# Altium project Ethernet2MIL Adapter.PrjPcb (part 1 of 3)
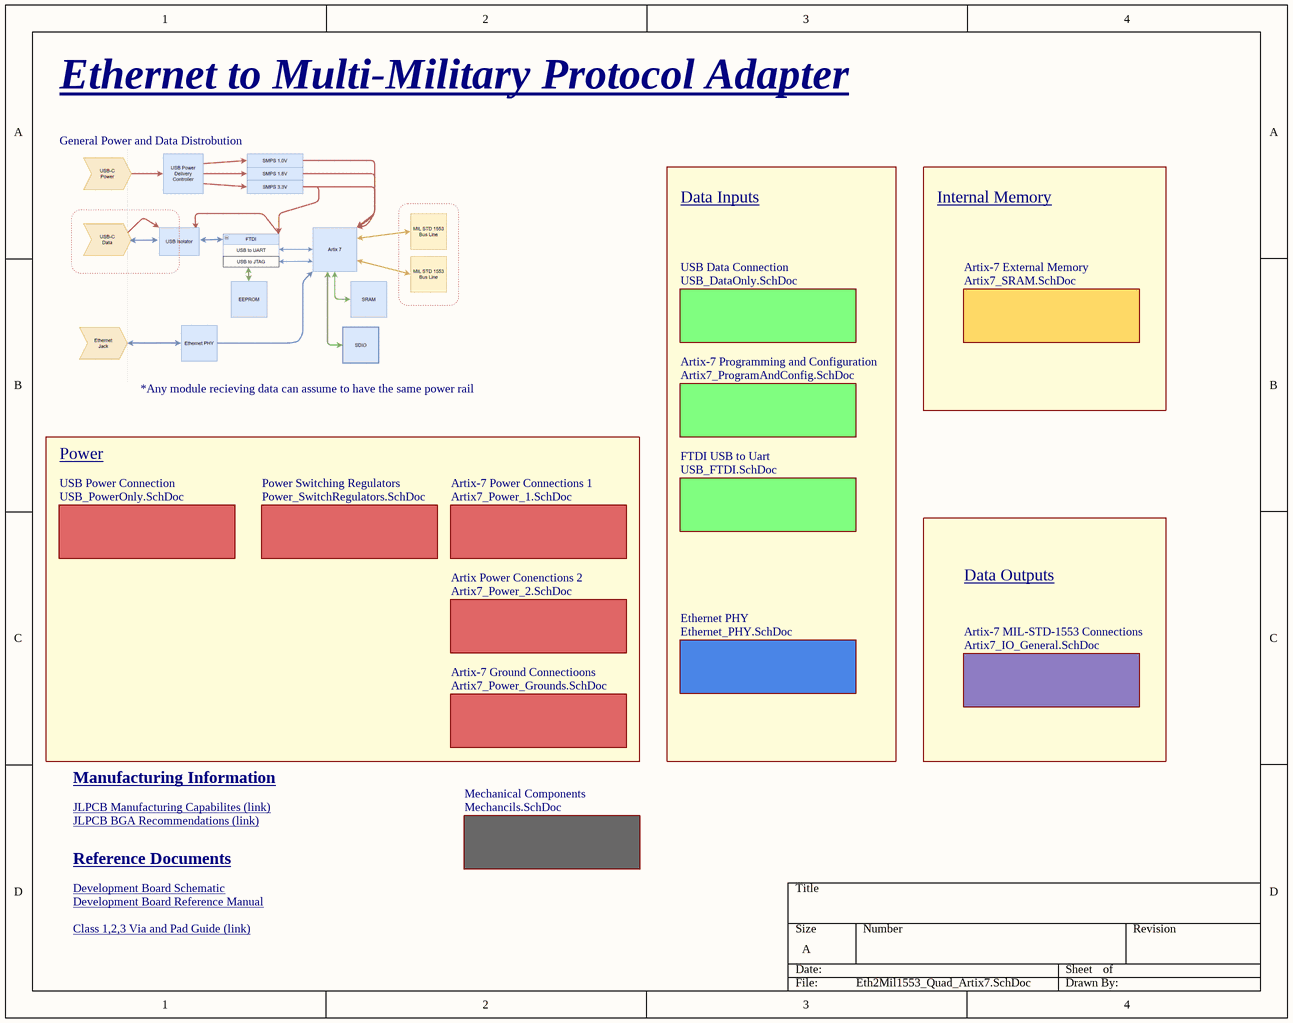
[diagram p0: Eth2Mil1553_Quad_Artix7.SchDoc]
Author: Cody States
13 sheets, 283 parts. Net scope: hierarchical (ports join the sheet entries above them; power ports are global).
Board file: Ethernet2Mil_Adapter_Dual.PcbDoc
Sheets:
  Eth2Mil1553_Quad_Artix7.SchDoc
    Artix-7 MIL-STD-1553 Connections = Artix7_IO_General.SchDoc
      1A = IO_MIL1553_TopConfiguration.SchDoc
      1B = IO_MIL1553_TopConfiguration.SchDoc
    Artix-7 Power Connections 1 = Artix7_Power_1.SchDoc
    Artix-7 Ground Connectioons = Artix7_Power_Grounds.SchDoc
    Artix-7 External Memory = Artix7_SRAM.SchDoc
    Ethernet PHY = Ethernet_PHY.SchDoc
    Mechanical Components = Mechancils.SchDoc
    Power Switching Regulators = Power_SwitchRegulators.SchDoc
    FTDI USB to Uart = USB_FTDI.SchDoc
    USB Power Connection = USB_PowerOnly.SchDoc
    USB Data Connection = USB_DataOnly.SchDoc
    Artix-7 Programming and Configuration = Artix7_ProgramAndConfig.SchDoc

## Sheet Eth2Mil1553_Quad_Artix7.SchDoc: STM32 MPU2 - Artix 7 Device Template
size A; SheetNumber: 1; SheetTotal: 14

### Sub-sheets
Artix Power Conenctions 2 = Artix7_Power_2.SchDoc (file not in this document): no entries
Artix-7 External Memory = Artix7_SRAM.SchDoc: no entries
Artix-7 Ground Connectioons = Artix7_Power_Grounds.SchDoc: no entries
Artix-7 MIL-STD-1553 Connections = Artix7_IO_General.SchDoc: no entries
Artix-7 Power Connections 1 = Artix7_Power_1.SchDoc: no entries
Artix-7 Programming and Configuration = Artix7_ProgramAndConfig.SchDoc: no entries
Ethernet PHY = Ethernet_PHY.SchDoc: no entries
FTDI USB to Uart = USB_FTDI.SchDoc: no entries
Mechanical Components = Mechancils.SchDoc: no entries
Power Switching Regulators = Power_SwitchRegulators.SchDoc: no entries
USB Data Connection = USB_DataOnly.SchDoc: no entries
USB Power Connection = USB_PowerOnly.SchDoc: no entries

### Notes on the sheet
- Ethernet to Multi-Military Protocol Adapter
- General Power and Data Distrobution
- Data Inputs
- Internal Memory
- *Any module recieving data can assume to have the same power rail
- Power
- Data Outputs
- JLPCB Manufacturing Capabilites (link) <https://jlcpcb.com/capabilities/pcb-capabilities>
- Manufacturing Information
- JLPCB BGA Recommendations (link) <https://jlcpcb.com/help/article/BGA-Design-Guidelines---PCB-Layout-Recommendations-for-BGA-packages>
- Reference Documents
- Development Board Schematic <https://digilent.com/reference/_media/reference/programmable-logic/cmod-a7/cmod_a7_sch_rev_c0.pdf?_gl=1*qkxv5u*_gcl_au*MjAxOTQ5MDM5OS4xNzQ2MzA4ODg3*_ga*MTA3MTgyNDA3MS4xNzQ0ODY4ODUx*_ga_JSPEFFCPBT*czE3NDc5NTE0MjMkbzQkZzEkdDE3NDc5NTE0MzAkajUzJGwwJGgxNjE3MDA2NTU0JGRWWFB3c3o4VGxNS2E4azhxR0phdjBGWmxjNUNlb0pRdkNR>
- Development Board Reference Manual <https://digilent.com/reference/programmable-logic/cmod-a7/reference-manual?redirect=1>
- Class 1,2,3 Via and Pad Guide (link) <https://resources.altium.com/p/pcb-size-and-pad-size-guidelines>

## Sheet Artix7_IO_General.SchDoc
size A3; SheetNumber: 12; SheetTotal: 14
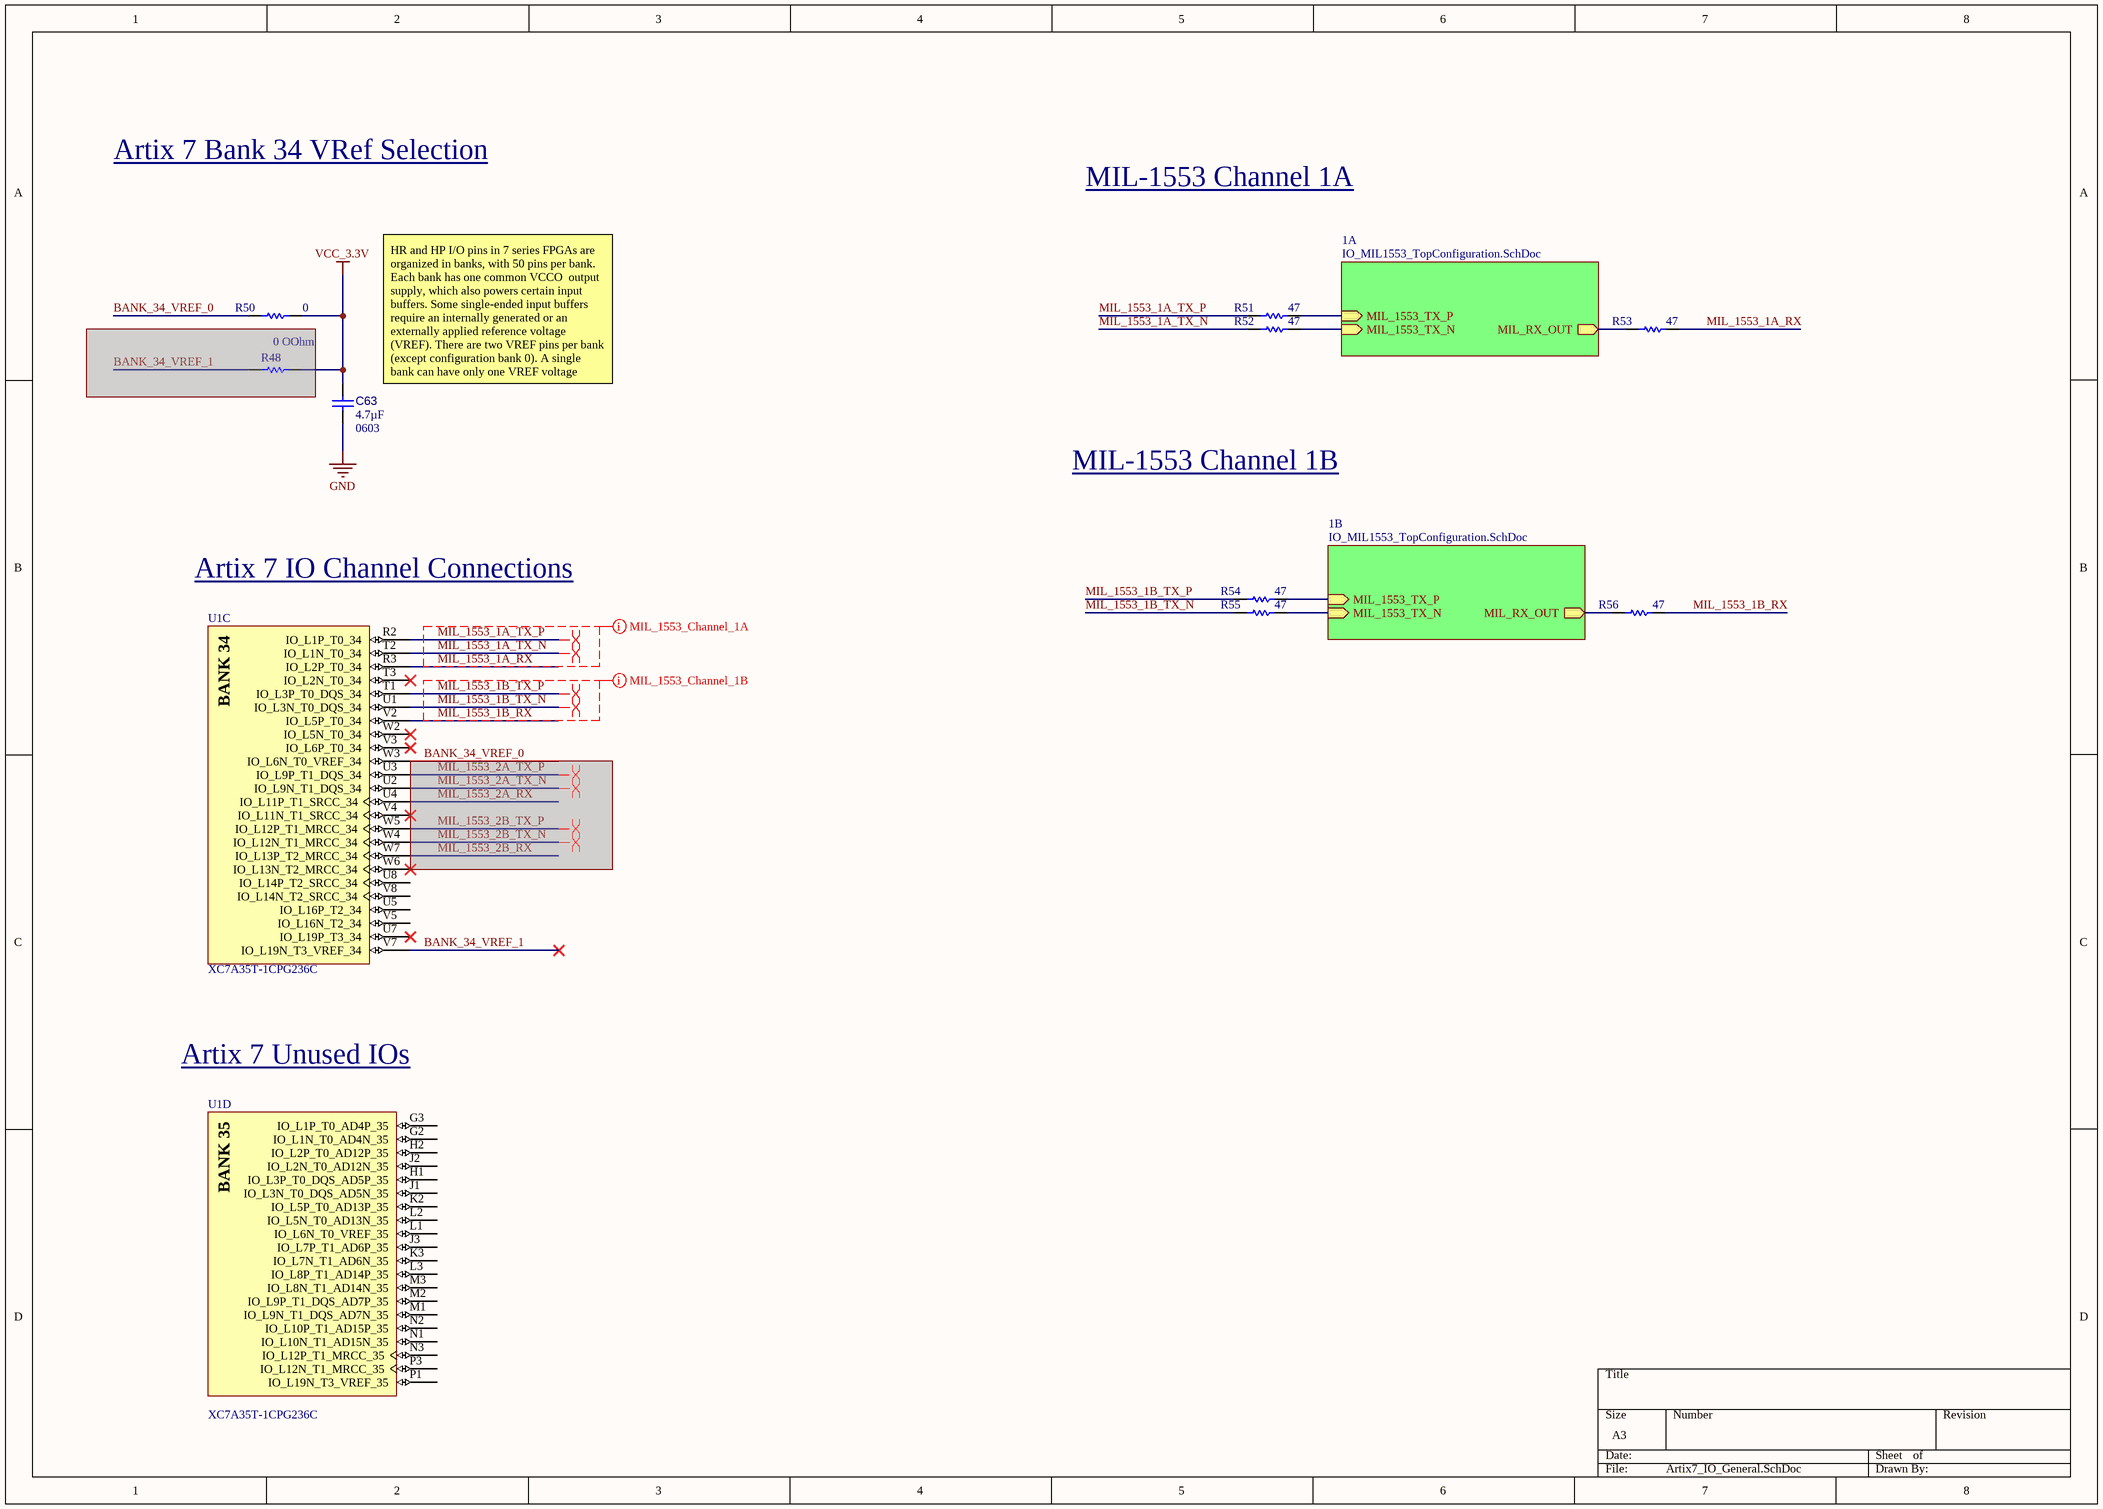
[diagram p1: Artix7_IO_General.SchDoc]

### Parts
C63  value 4.7µF  Case/Package: 0603  [CAPC0603(1608)100_L]  (hidden comment: Capacitor 4.7µF +/-20% 10V 0603)
R48  value 0 OOhm  [RESC1005X40X25ML05T05]  (hidden comment: Resistor 1k +/-1% 0402 100 mW)  (net tie)  (masked out: inside a compile mask, not in the netlist)
R50  value 0  [RESC1005X40X25ML05T05]  (hidden comment: Resistor 1k +/-1% 0402 100 mW)  (net tie)
R51  value 47  [RESC1005X40X25LL10T10]  (hidden comment: ERA-2AEB470X)
R52  value 47  [RESC1005X40X25LL10T10]  (hidden comment: ERA-2AEB470X)
R53  value 47  [RESC1005X40X25LL10T10]  (hidden comment: ERA-2AEB470X)
R54  value 47  [RESC1005X40X25LL10T10]  (hidden comment: ERA-2AEB470X)
R55  value 47  [RESC1005X40X25LL10T10]  (hidden comment: ERA-2AEB470X)
R56  value 47  [RESC1005X40X25LL10T10]  (hidden comment: ERA-2AEB470X)
U1  XC7A35T-1CPG236C  [CPG236]  (parts C,D of 10)

### Sub-sheets
1A = IO_MIL1553_TopConfiguration.SchDoc: MIL_1553_TX_N (in), MIL_1553_TX_P (in), MIL_RX_OUT (out)
1B = IO_MIL1553_TopConfiguration.SchDoc: MIL_1553_TX_N (in), MIL_1553_TX_P (in), MIL_RX_OUT (out)

### Nets
GND: C63.2
VCC_3.3V: C63.1 R50.1
BANK_34_VREF_0: R50.2
BANK_34_VREF_1: U1.V7(IO_L19N_T3_VREF_34)
MIL_1553_1A_RX: R53.2 U1.R3(IO_L2P_T0_34)
MIL_1553_1A_TX_N: R52.1 U1.T2(IO_L1N_T0_34)
MIL_1553_1A_TX_P: R51.1 U1.R2(IO_L1P_T0_34)
MIL_1553_1B_RX: R56.2 U1.V2(IO_L5P_T0_34)
MIL_1553_1B_TX_N: R55.1 U1.U1(IO_L3N_T0_DQS_34)
MIL_1553_1B_TX_P: R54.1 U1.T1(IO_L3P_T0_DQS_34)
RX_OUT: R53.1 ; sheet 1A/MIL_RX_OUT
RX_OUT: R56.1 ; sheet 1B/MIL_RX_OUT  [a separate net that carries the same name]
TX_OUT_N: R52.2 ; sheet 1A/MIL_1553_TX_N
TX_OUT_N: R55.2 ; sheet 1B/MIL_1553_TX_N  [a separate net that carries the same name]
TX_OUT_P: R51.2 ; sheet 1A/MIL_1553_TX_P
TX_OUT_P: R54.2 ; sheet 1B/MIL_1553_TX_P  [a separate net that carries the same name]

Not connected (* = marked no-connect by the designer): U1 G2(IO_L1N_T0_AD4N_35) G3(IO_L1P_T0_AD4P_35) H1(IO_L3P_T0_DQS_AD5P_35) H2(IO_L2P_T0_AD12P_35) J1(IO_L3N_T0_DQS_AD5N_35) J2(IO_L2N_T0_AD12N_35) J3(IO_L7P_T1_AD6P_35) K2(IO_L5P_T0_AD13P_35) K3(IO_L7N_T1_AD6N_35) L1(IO_L6N_T0_VREF_35) L2(IO_L5N_T0_AD13N_35) L3(IO_L8P_T1_AD14P_35) M1(IO_L9N_T1_DQS_AD7N_35) M2(IO_L9P_T1_DQS_AD7P_35) M3(IO_L8N_T1_AD14N_35) N1(IO_L10N_T1_AD15N_35) N2(IO_L10P_T1_AD15P_35) N3(IO_L12P_T1_MRCC_35) P1(IO_L19N_T3_VREF_35) P3(IO_L12N_T1_MRCC_35) T3(IO_L2N_T0_34)* U2(IO_L9N_T1_DQS_34) U3(IO_L9P_T1_DQS_34) U4(IO_L11P_T1_SRCC_34) U5(IO_L16P_T2_34) U7(IO_L19P_T3_34)* U8(IO_L14P_T2_SRCC_34) V3(IO_L6P_T0_34)* V4(IO_L11N_T1_SRCC_34)* V5(IO_L16N_T2_34) V8(IO_L14N_T2_SRCC_34) W2(IO_L5N_T0_34)* W3(IO_L6N_T0_VREF_34) W4(IO_L12N_T1_MRCC_34) W5(IO_L12P_T1_MRCC_34) W6(IO_L13N_T2_MRCC_34)* W7(IO_L13P_T2_MRCC_34)

### Layout directives
differential pair: (no net found under the mark), MIL_1553_1A_TX_N, MIL_1553_1A_TX_P, MIL_1553_1B_TX_N, MIL_1553_1B_TX_P
net class MIL1553 Channel 1A: MIL_1553_1A_RX, MIL_1553_1A_TX_N, MIL_1553_1A_TX_P
net class MIL1553 Channel 1B: MIL_1553_1B_RX, MIL_1553_1B_TX_N, MIL_1553_1B_TX_P

### Notes on the sheet
- Artix 7 Bank 34 VRef Selection
- MIL-1553 Channel 1A
- (near C63) HR and HP I/O pins in 7 series FPGAs are organized in banks, with 50 pins per bank. Each bank has one common VCCO  output supply, which also powers certain input buffers. Some single-ended input buffers require an internally generated or an  externally applied reference voltage (VREF). There are two VREF pins per bank (except configuration bank 0). A single bank can have only one VREF voltage value.
- MIL-1553 Channel 1B
- Artix 7 IO Channel Connections
- Artix 7 Unused IOs
- (in symbol CMP-0383-00006-1, part C) BANK 34
- (in symbol CMP-0383-00006-1, part D) BANK 35

### Library data of the parts
C63 = CMP-001-00076-5: Chip Capacitor, 4.7µF +/-20%, 10V, 0603, Thickness 1 mm; Tolerance: 10%; Max Operating Temperature: 85°C; Voltage Rating: 10V; Min Operating Temperature: -55°C; Pins: 2; Mounting Technology: SMT
R48 R50 = CMP-009-00009-5: Chip Resistor, 1 KOhm, +/- 1%, 0.1 W, -55 to 155 degC, 0402 (1005 Metric); Voltage Rating: 50V; Power: 100mW; Max Operating Temperature: 155°C; Tolerance: 1%; Case/Package: 0402; Min Operating Temperature: -55°C; RoHS Compliant: True; Mounting Technology: SM; Pins: 2
R51-R56 = CMP-009-00190-1: Fixed Resistor, Thin Film, 0.063W, 47ohm, 50V, 0.1% +/-Tol, 25ppm/Cel, Surface Mount, 0402; Power: 63mW; Min Operating Temperature: -55°C; Tolerance: 0.1%; Mounting Technology: Surface Mount; Max Operating Temperature: 155°C; RoHS Compliant: Yes; Case/Package: 0402; Pins: 2
U1 = CMP-0383-00006-1: Artix-7 FPGA, 106 User I/Os, 2 GTP, 238-Ball BGA, Speed Grade 1, Commercial Grade, Pb-Free; Manufacturer: Xilinx; CMTs: 5; Total Block RAM: 1800 Kb; Logic Cells: 33280; Speed Grades: 1; GTP: 2; Available User I/O: 106; ComponentLink1URL: http://www.xilinx.com/; Maximum Distributed RAM: 400 Kb; PackageVersion: Rev. 1.11; PartNumber: XC7A35T-1CPG236C; ComponentLink2URL: http://www.xilinx.com/support/documentation/data_sheets/ds180_7Series_Overview.pdf; DatasheetVersion: Rev. 1.15; ComponentLink1Description: Manufacturer URL; ComponentLink3Description: Pinout; ComponentLink4Description: Package Specification; Mounting Technology: Surface Mount; PackageReference: CPG-236; Operating Temperature Range: Commercial; PackageDescription: 238-Ball Wire-Bond Chip-Scale BGA, Body 10 x10 mm, Pitch 0.5 mm; ComponentLink3URL: http://www.xilinx.com/support/documentation/user_guides/ug475_7Series_Pkg_Pinout.pdf; ComponentLink4URL: http://www.xilinx.com/support/documentation/user_guides/ug475_7Series_Pkg_Pinout.pdf; ComponentLink2Description: Datasheet

## Sheet IO_MIL1553_TopConfiguration.SchDoc
size A3; SheetNumber: 13; SheetTotal: 14
Used 2 times, as channels Artix-7 MIL-STD-1553 Connections/1A, Artix-7 MIL-STD-1553 Connections/1B. Parts and nets are listed once, with the designators drawn on the sheet.
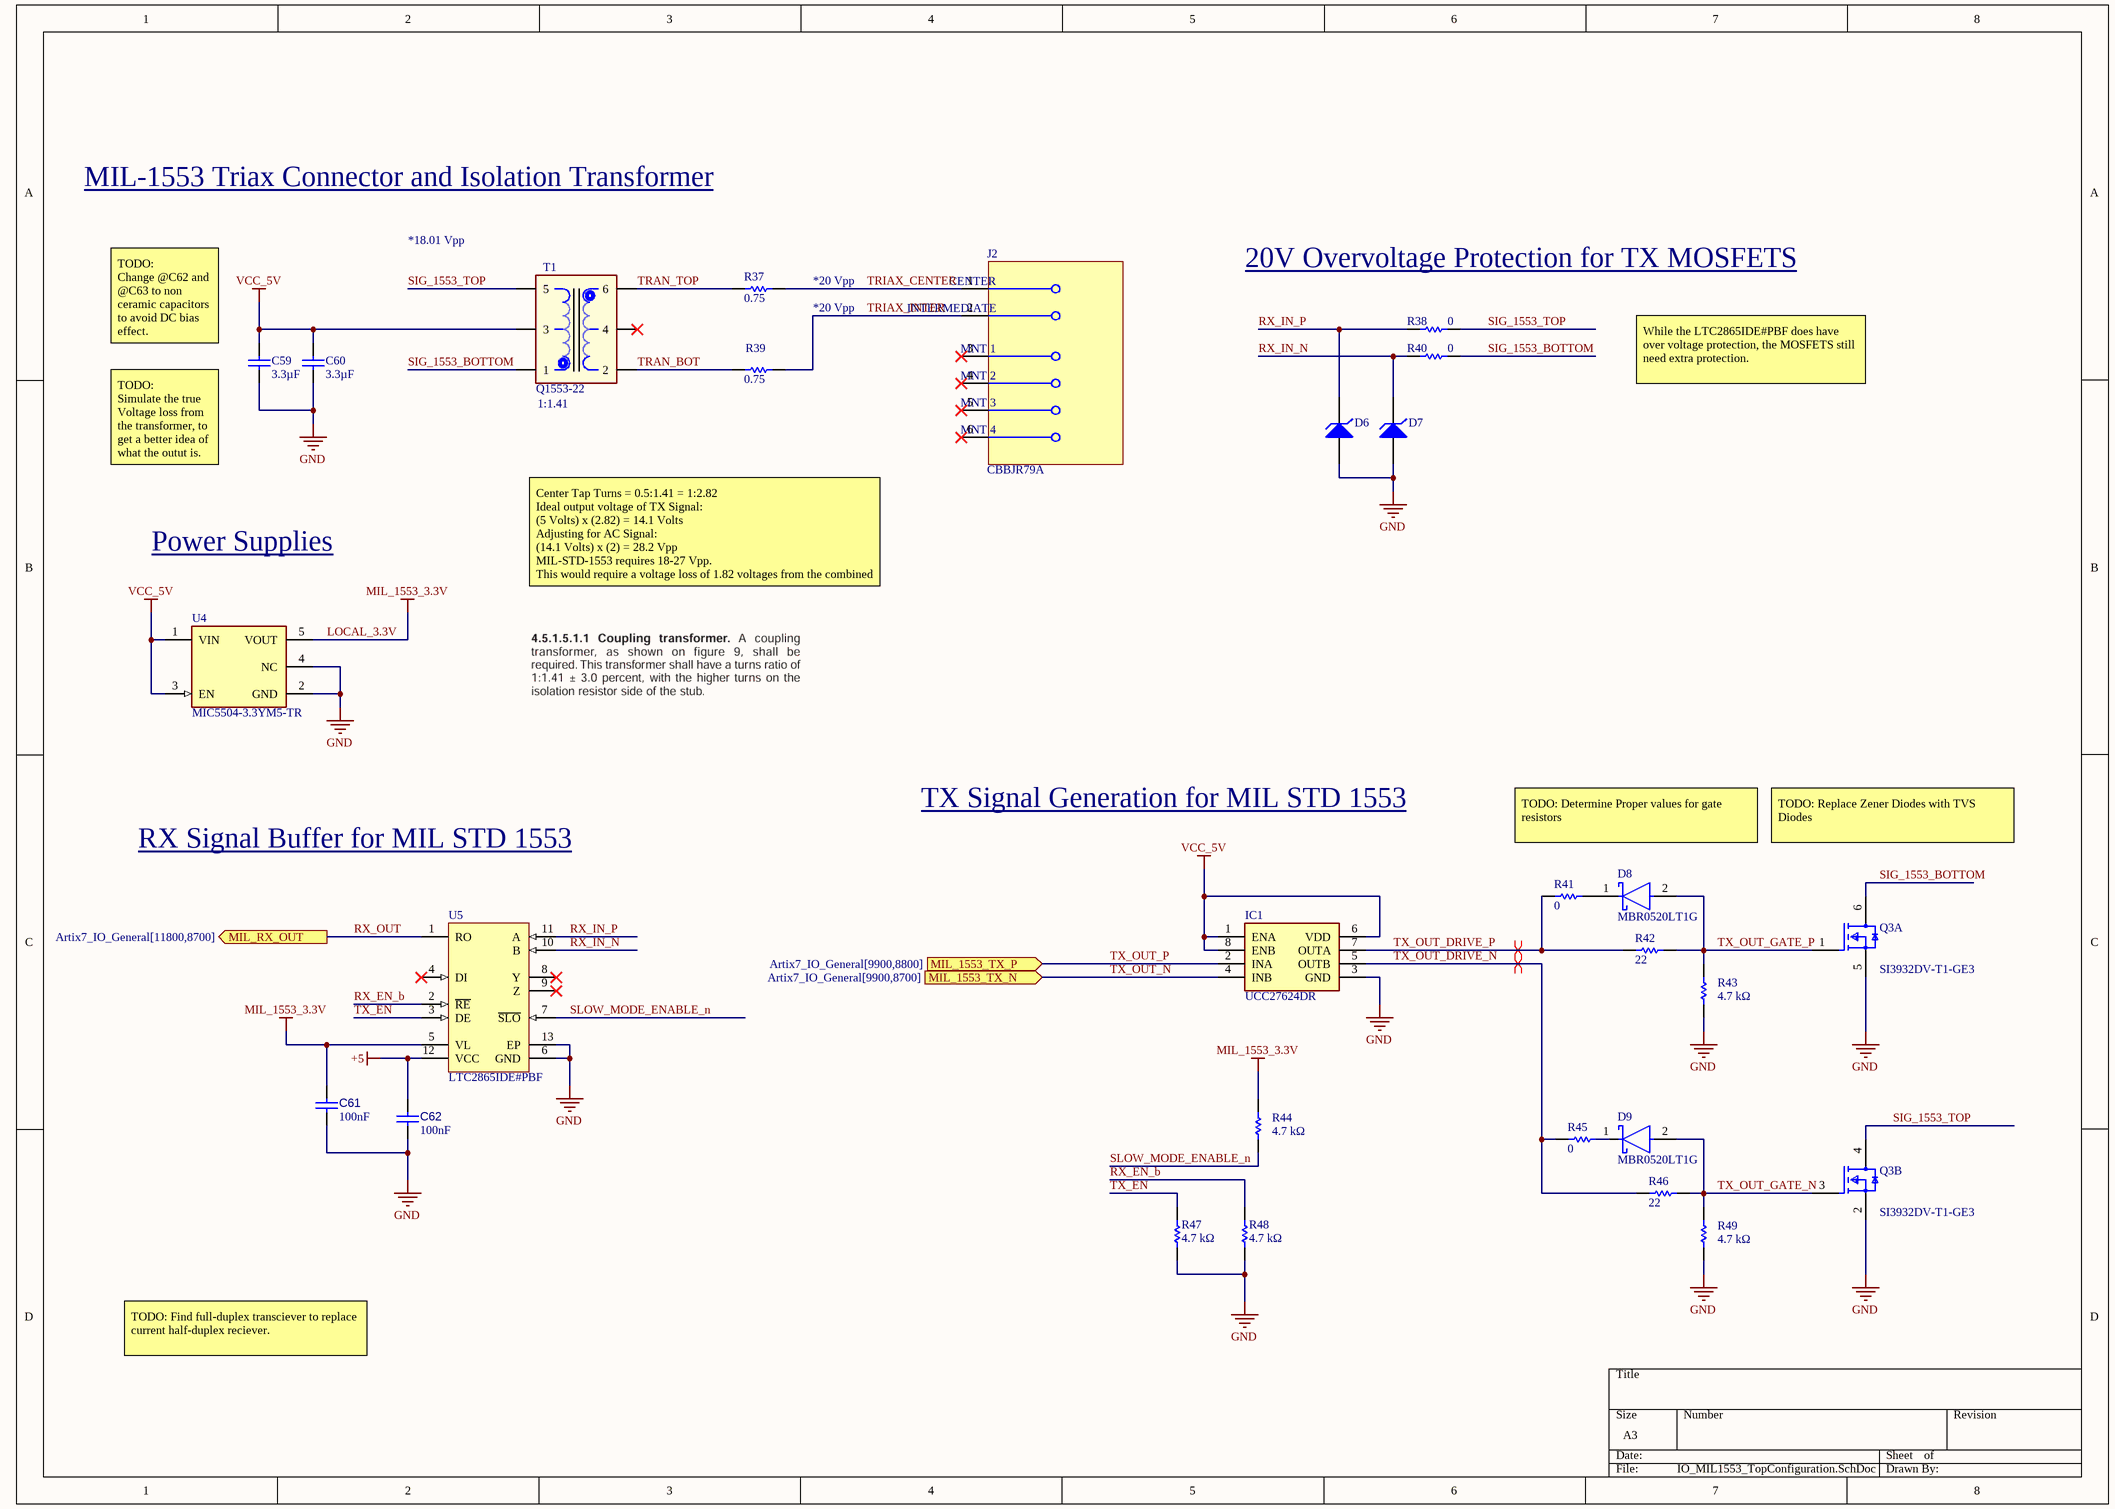
[diagram p2: IO_MIL1553_TopConfiguration.SchDoc]

### Parts
C59  value 3.3µF  [CAPC3325X279X50NL40T25]  (hidden comment: 12105C335KAT2A)
C60  value 3.3µF  [CAPC3325X279X50NL40T25]  (hidden comment: 12105C335KAT2A)
C61  value 100nF  [CAPC2013X145X48ML20T23]  (hidden comment: VJ0805Y104JXXAT)
C62  value 100nF  [CAPC2013X145X48ML20T23]  (hidden comment: VJ0805Y104JXXAT)
D6  SZ1SMA5932BT3G  [ONSC-SMA-2-403D-02_F_V]  (value not drawn)
D7  SZ1SMA5932BT3G  [ONSC-SMA-2-403D-02_F_V]  (value not drawn)
D8  MBR0520LT1G  [FP-425-04-IPC_A]
D9  MBR0520LT1G  [FP-425-04-IPC_A]
IC1  UCC27624DR  [SOIC127P600X175-8N]
J2  CBBJR79A  [CBBJR79A_MFG]
Q3  SI3932DV-T1-GE3  [FP-C-06593-6-IPC_B]  (parts A,B of 2)
R37  value 0.75  [RESC3125X70X40LL20T20]  (hidden comment: RES_0.75ohm_1W _1210)
R38  value 0  [RESC1608X55X25ML10T15]  (hidden comment: Resistor 0R +/- 5% 0603 100 mW)
R39  value 0.75  [RESC3125X70X40LL20T20]  (hidden comment: RES_0.75ohm_1W _1210)
R40  value 0  [RESC1608X55X25ML10T15]  (hidden comment: Resistor 0R +/- 5% 0603 100 mW)
R41  value 0  [RESC1608X55X25ML10T15]  (hidden comment: Resistor 0R +/- 5% 0603 100 mW)
R42  value 22  [RESC1608X55X25LL10T15]  (hidden comment: RC0603FR-0722RL)
R43  Resistance: 4.7 kΩ  [RESC1608X55X30LL15T15]  (hidden comment: ERJ-3EKF4701V)
R44  Resistance: 4.7 kΩ  [RESC1608X55X30LL15T15]  (hidden comment: ERJ-3EKF4701V)
R45  value 0  [RESC1608X55X25ML10T15]  (hidden comment: Resistor 0R +/- 5% 0603 100 mW)
R46  value 22  [RESC1608X55X25LL10T15]  (hidden comment: RC0603FR-0722RL)
R47  Resistance: 4.7 kΩ  [RESC1608X55X30LL15T15]  (hidden comment: ERJ-3EKF4701V)
R48  Resistance: 4.7 kΩ  [RESC1608X55X30LL15T15]  (hidden comment: ERJ-3EKF4701V)
R49  Resistance: 4.7 kΩ  [RESC1608X55X30LL15T15]  (hidden comment: ERJ-3EKF4701V)
T1  Turns Ratio: 1:1.41  [New footprint 1]  (hidden comment: Q1553-22)
U4  MIC5504-3.3YM5-TR  [FP-SOT23-5LD-PL-1-MFG]
U5  LTC2865IDE#PBF  [LT-DE-UE-12_V]

### Ports
MIL_1553_TX_N (in, see Artix7_IO_General[9900,8700]), MIL_1553_TX_P (in, see Artix7_IO_General[9900,8800]), MIL_RX_OUT (out, see Artix7_IO_General[11800,8700])

### Nets
+5: C62.2 U5.12(VCC)
GND: C59.1 C60.1 C61.1 C62.1 D6.2(A) D7.2(A) IC1.3(GND) Q3.2(S2) Q3.5(S1) R43.1 R47.1 R48.2 R49.1 U4.2(GND) U4.4(NC) U5.6(GND) U5.13(EP)
MIL_1553_3.3V: C61.2 R44.2 U4.5(VOUT) U5.5(VL)  [also labelled LOCAL_3.3V]
VCC_5V: C59.2 C60.2 IC1.1(ENA) IC1.6(VDD) IC1.8(ENB) T1.3 U4.1(VIN) U4.3(EN)
RX_EN_b: R48.1 U5.2(~{RE})
RX_IN_N: D7.1(K) R40.1 U5.10(B)
RX_IN_P: D6.1(K) R38.1 U5.11(A)
RX_OUT: U5.1(RO) ; port MIL_RX_OUT
SIG_1553_BOTTOM: Q3.6(D1) R40.2 T1.1
SIG_1553_TOP: Q3.4(D2) R38.2 T1.5
SLOW_MODE_ENABLE_n: R44.1 U5.7(~{SLO})
TRAN_BOT: R39.1 T1.2
TRAN_TOP: R37.1 T1.6
TRIAX_CENTER: J2.1(CENTER) R37.2
TRIAX_INTER: J2.2(INTERMEDIATE) R39.2
TX_EN: R47.2 U5.3(DE)
TX_OUT_DRIVE_N: IC1.5(OUTB) R45.1 R46.1
TX_OUT_DRIVE_P: IC1.7(OUTA) R41.1 R42.1
TX_OUT_GATE_N: D9.2(A) Q3.3(G2) R46.2 R49.2
TX_OUT_GATE_P: D8.2(A) Q3.1(G1) R42.2 R43.2
TX_OUT_N: IC1.4(INB) ; port MIL_1553_TX_N
TX_OUT_P: IC1.2(INA) ; port MIL_1553_TX_P
NetD8_1: D8.1(C) R41.2
NetD9_1: D9.1(C) R45.2

Not connected (* = marked no-connect by the designer): J2 3(MNT_1)* 4(MNT_2)* 5(MNT_3)* 6(MNT_4)*; T1 4*; U5 4(DI)* 8(Y)* 9(Z)*

### Channels
Artix-7 MIL-STD-1553 Connections/1A: designators end in .1; ports MIL_1553_TX_N=TX_OUT_N MIL_1553_TX_P=TX_OUT_P MIL_RX_OUT=RX_OUT
Artix-7 MIL-STD-1553 Connections/1B: designators end in .2; ports MIL_1553_TX_N=TX_OUT_N MIL_1553_TX_P=TX_OUT_P MIL_RX_OUT=RX_OUT

### Layout directives
differential pair: TX_OUT_DRIVE_N_1A, TX_OUT_DRIVE_P_1A

### Notes on the sheet
- MIL-1553 Triax Connector and Isolation Transformer
- *18.01 Vpp
- (near R37) *20 Vpp
- *20 Vpp
- 20V Overvoltage Protection for TX MOSFETS
- (near C59) TODO:
  Change @C62 and @C63 to non ceramic capacitors to avoid DC bias effect.
- While the LTC2865IDE#PBF does have over voltage protection, the MOSFETS still need extra protection.
- (near C59) TODO:
  Simulate the true Voltage loss from the transformer, to get a better idea of what the outut is.
  Ideal :
  (5 Volts) x (2) = 10 Vpp
- Power Supplies
- Center Tap Turns = 0.5:1.41 = 1:2.82
  Ideal output voltage of TX Signal:
  (5 Volts) x (2.82) = 14.1 Volts
  Adjusting for AC Signal:
  (14.1 Volts) x (2) = 28.2 Vpp
  MIL-STD-1553 requires 18-27 Vpp.
  This would require a voltage loss of 1.82 voltages from the combined losses of the transformer and the TX-Mosfets.
- RX Signal Buffer for MIL STD 1553
- TX Signal Generation for MIL STD 1553
- TODO: Determine Proper values for gate resistors
- TODO: Replace Zener Diodes with TVS Diodes
- (near Q3) SIG_1553_BOTTOM and SIG_1553_TOP are flipped for better component pin placement
- TODO: Find full-duplex transciever to replace current half-duplex reciever.

### Library data of the parts
C59 C60 = CMP-001-00086-1: Ceramic Capacitor, Multilayer, Ceramic, 50V, 10% +Tol, 10% -Tol, X7R, 15% TC, 3.3uF, Surface Mount, 1210; Max Operating Temperature: 125°C; Case/Package: 1210; Min Operating Temperature: -55°C; Pins: 2; Capacitor Type: Ceramic; RoHS Compliant: Yes; Mounting Technology: Surface Mount
C61 C62 = CMP-001-00087-1: Ceramic Capacitor, Multilayer, Ceramic, 25V, 5% +Tol, 5% -Tol, X7R, 15% TC, 0.1uF, Surface Mount, 0805; Min Operating Temperature: -55°C; Case/Package: 0805; Max Operating Temperature: 125°C; Capacitor Type: Ceramic; Mounting Technology: Surface Mount; Pins: 2; RoHS Compliant: Yes
D6 D7 = CMP-004-00033-1: Zener Diode, 20V V(Z), 5%, 0.5W, Silicon, Unidirectional; Min Operating Temperature: -65°C; RoHS Compliant: Yes; Max Operating Temperature: 150°C; Pins: 2
D8 D9 = CMP-004-00035-1: Rectifier Diode, Schottky, 1 Phase, 1 Element, 0.5A, 20V V(RRM), Silicon; Forward Voltage: 385mV; Max Operating Temperature: 125°C; Min Operating Temperature: -65°C; RoHS Compliant: Yes; Pins: 2
IC1 = UCC27624DR: Integrated Circuit; Manufacturer_Name: Texas Instruments; Datasheet Link: https://www.ti.com/lit/ds/symlink/ucc27624.pdf?ts=1654150888910&ref_url=https%253A%252F%252Fwww.ti.com%252Fproduct%252FUCC27624; Height: 1.75mm; Manufacturer_Part_Number: UCC27624DR; Mouser Part Number: 595-UCC27624DR; Mouser Price/Stock: https://www.mouser.co.uk/ProductDetail/Texas-Instruments/UCC27624DR?qs=Rp5uXu7WBW%2FHvRoPIZ55DQ%3D%3D; Arrow Part Number: UCC27624DR; Arrow Price/Stock: https://www.arrow.com/en/products/ucc27624dr/texas-instruments?utm_currency=USD&region=nac; Supplier 1: Digikey; Supplier Part Number 1: 296-UCC27624DRCT-ND
J2 = CMP-12141-47771416-2: RF Triaxial-BNC Connector, Female, Panel Mount, Board And Panel Mount, Solder Terminal, Jack; Number of Contacts: 2; Body Plating: Tin; Frequency: 500MHz; Voltage Rating: 400V; Connector Type: Coaxial, Socket; Body Material: Brass; Dielectric Material: PTFE; Contact Material: Gold; ComponentLink2URL: https://www.belfuse.com/resources/drawings/cinchconnectivitysolutions/trompeter/dr-ccs-trom-cbbjr79a.pdf; Contact Plating: Gold; Housing Color: Silver; Fastening Type: Bayonet; Orientation: Right Angle; REACH SVHC: No SVHC; HelpURL: https://www.belfuse.com/resources/drawings/cinchconnectivitysolutions/trompeter/dr-ccs-trom-cbbjr79a.pdf; Min Operating Temperature: -65°C; Radiation Hardening: No; Max Frequency: 500MHz; RoHS: Compliant; Max Operating Temperature: 165°C; Gender: Female; ComponentLink2Description: Datasheet URL; Mount: Bulkhead, Panel, Through Hole; Termination: Solder
Q3 = CMP-013-00035-1: Small Signal Field-Effect Transistor, 3.7A I(D), 30V, 2-Element, N-Channel, Silicon, Metal-oxide Semiconductor FET; RoHS Compliant: Yes; Max Operating Temperature: 150°C; Pins: 6
R37 R39 = CMP-009-00187-2: Fixed Resistor, Metal Glaze/thick Film, 1W, 0.75ohm, 0.866V, 1% +/-Tol, 100ppm/Cel, Surface Mount, 1210; Power: 1W; RoHS Compliant: Yes; Case/Package: 1210; Pins: 2; Min Operating Temperature: -55°C; Max Operating Temperature: 155°C; Mounting Technology: Surface Mount; Tolerance: 1%
R38 R40 R41 R45 = CMP-009-00006-5: Chip Resistor, 0 Ohm, 0.1 W, -55 to 155 degC, 0603 (1608 Metric); Power: 100mW; Voltage Rating: 50V; Max Operating Temperature: 155°C; RoHS Compliant: True; Mounting Technology: SM; Case/Package: 0603; Min Operating Temperature: -55°C; Tolerance: 5%; Pins: 2
R42 R46 = CMP-009-00189-1: Fixed Resistor, Metal Glaze/thick Film, 0.1W, 22ohm, 75V, 1% +/-Tol, 100ppm/Cel, Surface Mount, 0603; Power: 100mW; Min Operating Temperature: -55°C; RoHS Compliant: Yes; Mounting Technology: Surface Mount; Case/Package: 0603; Tolerance: 1%; Max Operating Temperature: 155°C; Pins: 2
R43 R44 R47-R49 = CMP-009-00185-1: Fixed Resistor, Metal Glaze/thick Film, 0.1W, 4700ohm, 75V, 1% +/-Tol, 100ppm/Cel, Surface Mount, 0603; Power: 100mW; Value: 4.7k; Max Operating Temperature: 155°C; Tolerance: 1%; Mounting Technology: Surface Mount; RoHS Compliant: Yes; Min Operating Temperature: -55°C; Case/Package: 0603; Pins: 2
T1 = CMP-012-00001-4: Pulse Transformer, GENERAL PURPOSE Application(s), 1CT:1.41CT; Pin Width Tolerance: 0.050 mm; Pin Width: 0.51 mm; Pins: 6; Case/Package: THT; Min Operating Temperature: -55°C; Max Operating Temperature: 130°C; Mounting Technology: Through Hole
U4 = CMP-2000-07604-2: IC REG LINEAR 3.3V 300MA SOT23-5; Quiescent Current: 38uA; Operating Supply Current: 42uA; Max Input Voltage: 5.5V; Min Input Voltage: 2.5V; Output Type: Fixed; Power Supply Rejection Ratio (PSRR): 60dB; Dropout Voltage: 380mV; Accuracy: 3%; Number of Outputs: 1; Nominal Output Voltage: 3.3V; Max Output Current: 300mA; Length: 2.9mm; Mount: Surface Mount; Width: 1.6mm; Packaging: Tape and Reel; Output Current: 300mA; Min Operating Temperature: -40°C; Max Operating Temperature: 125°C; Height: 1.1mm; Case/Package: SOT-23-5; REACH SVHC: No SVHC; Number of Pins: 5; Output Voltage: 3.3V
U5 = CMP-015-00008-1: Line Transceiver, 1 Func, 1 Driver, 1 Rcvr, CMOS, PDSO12; Max Supply Voltage: 5.5V; Min Supply Voltage: 3V; Nominal Supply Voltage: 3.3V; Case/Package: HVSON; Max Operating Temperature: 85°C; Min Operating Temperature: -40°C; RoHS Compliant: Yes; Pins: 12; ComponentLink1Description: Datasheet Link; ComponentLink1URL: https://www.analog.com/media/en/technical-documentation/data-sheets/2862345fc.pdf

## Sheet Artix7_Power_1.SchDoc
size A3; SheetNumber: 4; SheetTotal: 14
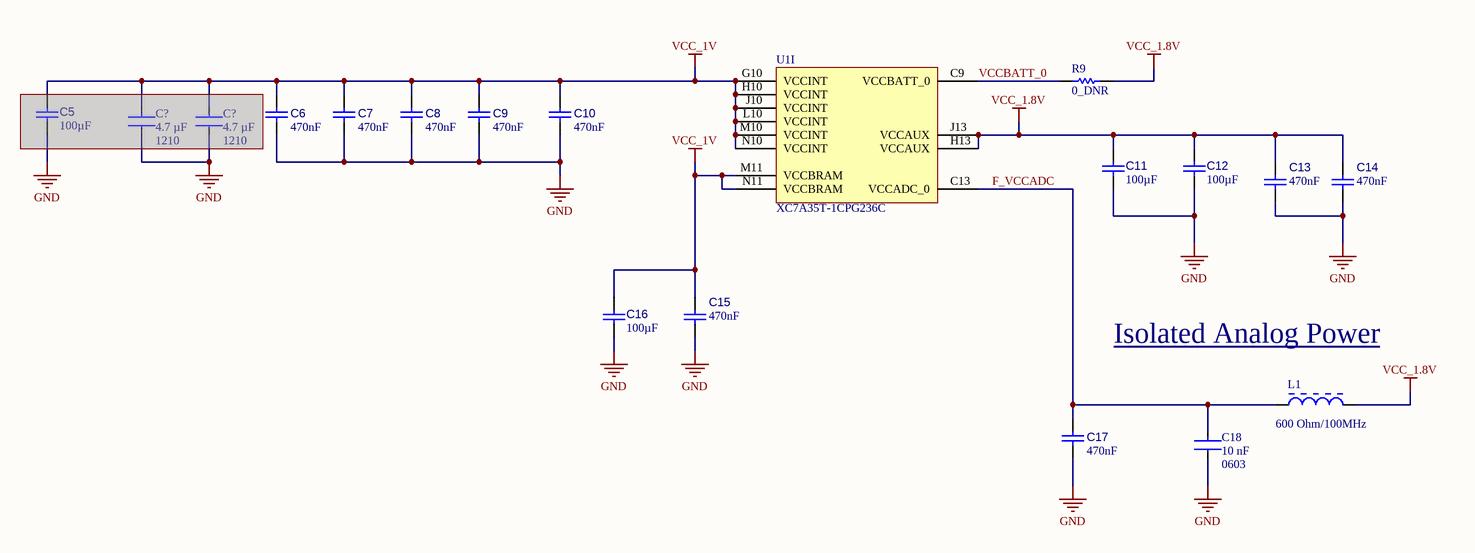
[diagram p3: Artix7_Power_1.SchDoc]

### Parts
(Parts that share a designator on the sheet are numbered #1, #2 ... from top to bottom, then left to right.)
C5  value 100µF  [CAPC0805(2012)145_L]  (hidden comment: Capacitor 100µF +/-20% 6.3V 0805)  (masked out: inside a compile mask, not in the netlist)
C6  value 470nF  [CAPC0402(1005)60_L]  (hidden comment: Capacitor 470nF +/-40% 10V 0402)
C7  value 470nF  [CAPC0402(1005)60_L]  (hidden comment: Capacitor 470nF +/-40% 10V 0402)
C8  value 470nF  [CAPC0402(1005)60_L]  (hidden comment: Capacitor 470nF +/-40% 10V 0402)
C9  value 470nF  [CAPC0402(1005)60_L]  (hidden comment: Capacitor 470nF +/-40% 10V 0402)
C10  value 470nF  [CAPC0402(1005)60_L]  (hidden comment: Capacitor 470nF +/-40% 10V 0402)
C11  value 100µF  [CAPC0805(2012)145_L]  (hidden comment: Capacitor 100µF +/-20% 6.3V 0805)
C12  value 100µF  [CAPC0805(2012)145_L]  (hidden comment: Capacitor 100µF +/-20% 6.3V 0805)
C13  value 470nF  [CAPC0402(1005)60_L]  (hidden comment: Capacitor 470nF +/-40% 10V 0402)
C14  value 470nF  [CAPC0402(1005)60_L]  (hidden comment: Capacitor 470nF +/-40% 10V 0402)
C15  value 470nF  [CAPC0402(1005)60_L]  (hidden comment: Capacitor 470nF +/-40% 10V 0402)
C16  value 100µF  [CAPC0805(2012)145_L]  (hidden comment: Capacitor 100µF +/-20% 6.3V 0805)
C17  value 470nF  [CAPC0402(1005)60_L]  (hidden comment: Capacitor 470nF +/-40% 10V 0402)
C18  Case Code (Imperial): 0603  Capacitance: 10 nF  [FP-0603-L_1_6_0_1-W_0_8_0-MFG]  (hidden comment: EMK107SD103KA-T)
C?#1  Case/Package: 1210  Capacitance: 4.7 µF  [FP-1210-L_3_3_0_4-W_2_5_0-IPC_B]  (hidden comment: 12105C475K4Z2A)  (masked out: inside a compile mask, not in the netlist)
C?#2  Case/Package: 1210  Capacitance: 4.7 µF  [FP-1210-L_3_3_0_4-W_2_5_0-IPC_B]  (hidden comment: 12105C475K4Z2A)  (masked out: inside a compile mask, not in the netlist)
L1  OhmAtFreq: 600 Ohm/100MHz  [BOUR-SRN3015-2_V]  (hidden comment: SRN3015-3R3M)
R9  value 0_DNR  [RESC0402(1005)_L]  (hidden comment: Resistor 10R  +/-1 % 0402 63 mW)
U1  XC7A35T-1CPG236C  [CPG236]  (part I of 10)

### Nets
GND: C6.2 C7.2 C8.2 C9.2 C10.2 C11.2 C12.2 C13.2 C14.1 C15.1 C16.2 C17.1 C18.2
VCC_1.8V: C11.1 C12.1 C13.1 C14.2 L1.1 R9.2 U1.H13(VCCAUX) U1.J13(VCCAUX)
VCC_1V: C6.1 C7.1 C8.1 C9.1 C10.1 C15.2 C16.1 U1.G10(VCCINT) U1.H10(VCCINT) U1.J10(VCCINT) U1.L10(VCCINT) U1.M10(VCCINT) U1.M11(VCCBRAM) U1.N10(VCCINT) U1.N11(VCCBRAM)
F_VCCADC: C17.2 C18.1 L1.2 U1.C13(VCCADC_0)
VCCBATT_0: R9.1 U1.C9(VCCBATT_0)

### Notes on the sheet
- Isolated Analog Power

### Library data of the parts
C5 C11 C12 C16 = CMP-001-00054-5: Chip Capacitor, 100µF +/-20%, 6.3V, 0805, Thickness 1.45 mm; Tolerance: 10%; Voltage Rating: 6.3V; Min Operating Temperature: -55°C; Case/Package: 0805; Max Operating Temperature: 85°C; Mounting Technology: SMT; Pins: 2
C6-C10 C13-C15 C17 = CMP-001-00060-5: Chip Capacitor, 470nF +/-40%, 10V, 0402, Thickness 0.6 mm; Tolerance: 20%; Max Operating Temperature: 85°C; Min Operating Temperature: -55°C; Case/Package: 0402; Voltage Rating: 10V; Mounting Technology: SMT; Pins: 2
C18 = CMP-14477-001835-2: None; Voltage Rating (DC): 16V; Tolerance: 10%; Mount: Surface Mount; Lead Free: Lead Free; Min Operating Temperature: -55°C; Resistor Type: Ceramic; Voltage Rating: 16V; Package Quantity: 1; RoHS Compliant: Yes; Case/Package: 0603; Length: 1.6mm; Radiation Hardening: No; Halogen Free: Halogen Free; Max Operating Temperature: 125°C; Thickness: 0.035inch; Termination: SMD/SMT; Case Code (Metric): 1608; Packaging: Tape and Reel; Weight: 7.1E-05oz; Width: 0.031inch; Construction: Flat; Height: 0.8mm; Depth: 0.8mm; Series: CFCAP™
C?#1 C?#2 = CMP-04427-013061-1: Automotive Ceramic Capacitor, 1210, 4.7uF, 10%, X7R, 15%, 50V; Dissipation Factor: 2.5%; Length: 3.2mm; Termination: SMD/SMT; Height: 2.79mm; Package Quantity: 1; Tolerance: 10%; Lead Free: Lead Free; Max Operating Temperature: 125°C; Number of Pins: 2; Voltage Rating (DC): 50V; Depth: 2.5mm; REACH SVHC: No SVHC; Series: FLEXITERM®; Construction: Flat; RoHS Compliant: Yes; Thickness: 0.11inch; Dielectric: X7R; Width: 0.098inch; Mount: Surface Mount; Packaging: Tape and Reel; Features: Soft Termination; Case Code (Metric): 3225; Voltage Rating: 50V; Case Code (Imperial): 1210; Min Operating Temperature: -55°C; Contact Plating: Tin; Ratings: AEC-Q200; Radiation Hardening: No
L1 = CMP-0007-00001-1: Semi-shielded Power Inductor, 3.3 uH, +/- 20%, 1.6 A, -40 to 125 degC, 3 x 3 x 1.5 mm SMD, RoHS and Halogen Free, Tape and Reel; Manufacturer: Bourns; DCR Max: 0.112 Ohm; Resistance to Solder Heat: +260 degC for 10 sec.; Inductance: 3.3 uH; Rated current: 1.6 A; SRF Min: 75 MHz; Isat: 1.4 A; Inductance tolerance: +/- 20%; PackageDescription: 2-Pin SMD, Body 3 x 3 mm, Height 1.5 mm; ComponentLink1URL: http://www.bourns.com/; ComponentLink3URL: http://www.bourns.com/data/global/pdfs/SRN3015.pdf; RoHS: TRUE; ComponentLink2URL: http://www.bourns.com/data/global/pdfs/SRN3015.pdf; DatasheetVersion: Aug-11; ComponentLink3Description: Package Specification; PartNumber: SRN3015-3R3M; ComponentLink2Description: Datasheet; Packing: Tape and Reel; ComponentLink1Description: Manufacturer URL; Mounting Technology: Surface Mount; PackageReference: SRN3015; Operating Temperature: -40 to 125 degC
R9 = CMP-009-00152-4: Chip Resistor, 10 Ohms, +/-1 %, 63 mW, -55 to 155 degC, 0402; Power: 63mW; Tolerance: 1%; Pins: 2; Case/Package: 0402; Max Operating Temperature: 155°C; Min Operating Temperature: -55°C
U1 = CMP-0383-00006-1: as U1 on sheet Artix7_IO_General; ComponentLink1URL: http://www.xilinx.com/; Maximum Distributed RAM: 400 Kb; PackageVersion: Rev. 1.11; PartNumber: XC7A35T-1CPG236C; ComponentLink2URL: http://www.xilinx.com/support/documentation/data_sheets/ds180_7Series_Overview.pdf; DatasheetVersion: Rev. 1.15; ComponentLink1Description: Manufacturer URL; ComponentLink3Description: Pinout; ComponentLink4Description: Package Specification; Mounting Technology: Surface Mount; PackageReference: CPG-236; Operating Temperature Range: Commercial; PackageDescription: 238-Ball Wire-Bond Chip-Scale BGA, Body 10 x10 mm, Pitch 0.5 mm; ComponentLink3URL: http://www.xilinx.com/support/documentation/user_guides/ug475_7Series_Pkg_Pinout.pdf; ComponentLink4URL: http://www.xilinx.com/support/documentation/user_guides/ug475_7Series_Pkg_Pinout.pdf; ComponentLink2Description: Datasheet

## Sheet Artix7_Power_Grounds.SchDoc
size A3; SheetNumber: 6; SheetTotal: 14
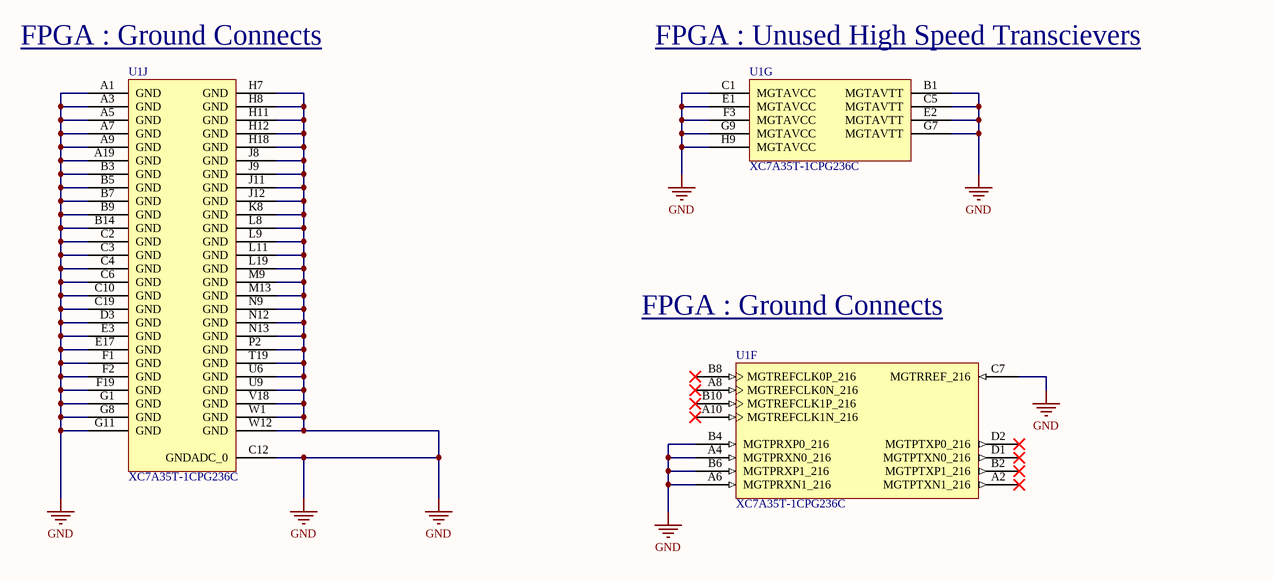
[diagram p4: Artix7_Power_Grounds.SchDoc]

### Parts
U1  XC7A35T-1CPG236C  [CPG236]  (parts F,G,J of 10)

### Nets
GND: U1.A1(GND) U1.A3(GND) U1.A4(MGTPRXN0_216) U1.A5(GND) U1.A6(MGTPRXN1_216) U1.A7(GND) U1.A9(GND) U1.A19(GND) U1.B1(MGTAVTT) U1.B3(GND) U1.B4(MGTPRXP0_216) U1.B5(GND) U1.B6(MGTPRXP1_216) U1.B7(GND) U1.B9(GND) U1.B14(GND) U1.C1(MGTAVCC) U1.C2(GND) U1.C3(GND) U1.C4(GND) U1.C5(MGTAVTT) U1.C6(GND) U1.C7(MGTRREF_216) U1.C10(GND) U1.C12(GNDADC_0) U1.C19(GND) U1.D3(GND) U1.E1(MGTAVCC) U1.E2(MGTAVTT) U1.E3(GND) U1.E17(GND) U1.F1(GND) U1.F2(GND) U1.F3(MGTAVCC) U1.F19(GND) U1.G1(GND) U1.G7(MGTAVTT) U1.G8(GND) U1.G9(MGTAVCC) U1.G11(GND) U1.H7(GND) U1.H8(GND) U1.H9(MGTAVCC) U1.H11(GND) U1.H12(GND) U1.H18(GND) U1.J8(GND) U1.J9(GND) U1.J11(GND) U1.J12(GND) U1.K8(GND) U1.L8(GND) U1.L9(GND) U1.L11(GND) U1.L19(GND) U1.M9(GND) U1.M13(GND) U1.N9(GND) U1.N12(GND) U1.N13(GND) U1.P2(GND) U1.T19(GND) U1.U6(GND) U1.U9(GND) U1.V18(GND) U1.W1(GND) U1.W12(GND)

Not connected (* = marked no-connect by the designer): U1 A2(MGTPTXN1_216)* A8(MGTREFCLK0N_216)* A10(MGTREFCLK1N_216)* B2(MGTPTXP1_216)* B8(MGTREFCLK0P_216)* B10(MGTREFCLK1P_216)* D1(MGTPTXN0_216)* D2(MGTPTXP0_216)*

### Notes on the sheet
- (near U1) FPGA : Ground Connects
- (near U1) FPGA : Unused High Speed Transcievers
- FPGA : Ground Connects

### Library data of the parts
U1 = CMP-0383-00006-1: as U1 on sheet Artix7_IO_General; ComponentLink1URL: http://www.xilinx.com/; Maximum Distributed RAM: 400 Kb; PackageVersion: Rev. 1.11; PartNumber: XC7A35T-1CPG236C; ComponentLink2URL: http://www.xilinx.com/support/documentation/data_sheets/ds180_7Series_Overview.pdf; DatasheetVersion: Rev. 1.15; ComponentLink1Description: Manufacturer URL; ComponentLink3Description: Pinout; ComponentLink4Description: Package Specification; Mounting Technology: Surface Mount; PackageReference: CPG-236; Operating Temperature Range: Commercial; PackageDescription: 238-Ball Wire-Bond Chip-Scale BGA, Body 10 x10 mm, Pitch 0.5 mm; ComponentLink3URL: http://www.xilinx.com/support/documentation/user_guides/ug475_7Series_Pkg_Pinout.pdf; ComponentLink4URL: http://www.xilinx.com/support/documentation/user_guides/ug475_7Series_Pkg_Pinout.pdf; ComponentLink2Description: Datasheet

## Sheet Artix7_SRAM.SchDoc
size A3; SheetNumber: 7; SheetTotal: 14
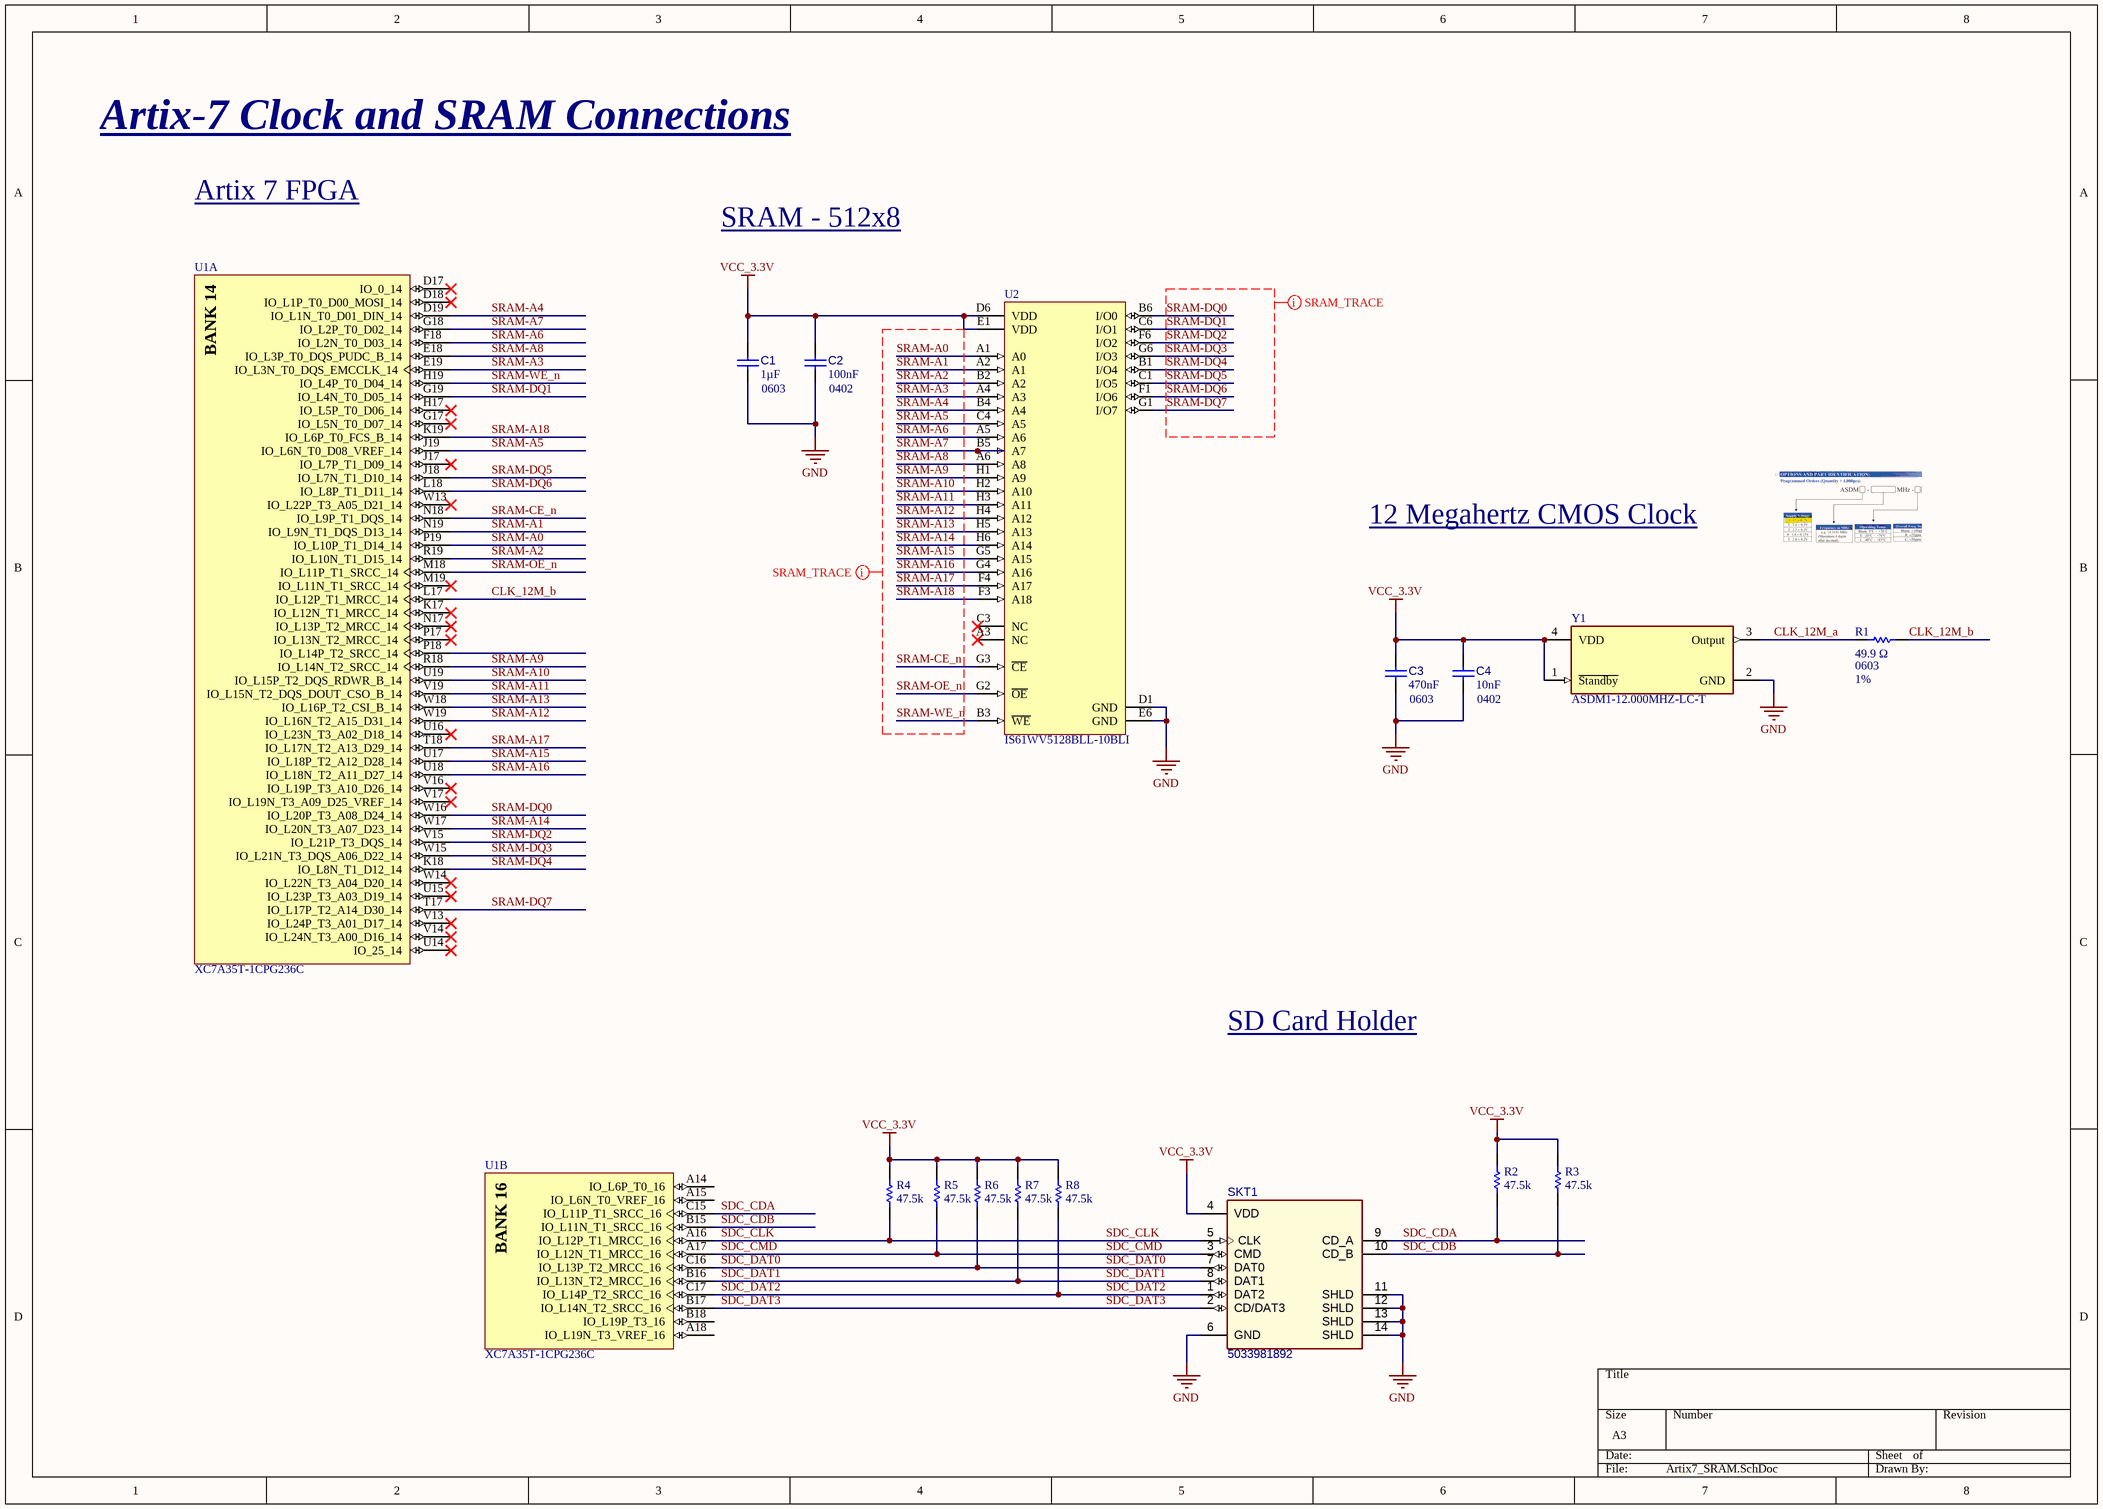
[diagram p5: Artix7_SRAM.SchDoc]

### Parts
C1  value 1µF  Case/Package: 0603  [CAPC0603(1608)100_L]  (hidden comment: Capacitor 1µF +/-0.1% 25V 0603)
C2  value 100nF  Case/Package: 0402  [CAPC0402(1005)60_L]  (hidden comment: Capacitor 100nF +/-20% 25V 0402)
C3  value 470nF  Case/Package: 0603  [CAPC0603(1608)100_L]  (hidden comment: Capacitor 470nF +/-20% 25V 0603)
C4  value 10nF  Case/Package: 0402  [CAPC0402(1005)60_L]  (hidden comment: Capacitor 10nF +/-20% 50V 0402)
R1  value 49.9 Ω  PackageReference: 0603  Tolerance: 1%  [RESC1608X55X25NL10T15]  (hidden comment: RC0603FR-0749R9L)
R2  value 47.5k  [RESC0402(1005)_L]  (hidden comment: 47D5KR2F)
R3  value 47.5k  [RESC0402(1005)_L]  (hidden comment: 47D5KR2F)
R4  value 47.5k  [RESC0402(1005)_L]  (hidden comment: 47D5KR2F)
R5  value 47.5k  [RESC0402(1005)_L]  (hidden comment: 47D5KR2F)
R6  value 47.5k  [RESC0402(1005)_L]  (hidden comment: 47D5KR2F)
R7  value 47.5k  [RESC0402(1005)_L]  (hidden comment: 47D5KR2F)
R8  value 47.5k  [RESC0402(1005)_L]  (hidden comment: 47D5KR2F)
SKT1  5033981892  [MOLX-5033981892_V]
U1  XC7A35T-1CPG236C  [CPG236]  (parts A,B of 10)
U2  IS61WV5128BLL-10BLI  [FP-IS61WV5128BLL-10BLI-IPC_A]
Y1  ASDM1-12.000MHZ-LC-T  [FP-ASDM-ASDMB-MFG]

### Nets
GND: C1.1 C2.1 C3.1 C4.2 SKT1.6(GND) SKT1.11(SHLD) SKT1.12(SHLD) SKT1.13(SHLD) SKT1.14(SHLD) U2.D1(GND) U2.E6(GND) Y1.2(GND)
VCC_3.3V: C1.2 C2.2 C3.2 C4.1 R2.2 R3.2 R4.2 R5.2 R6.2 R7.2 R8.2 SKT1.4(VDD) U2.D6(VDD) U2.E1(VDD) Y1.1(~{Standby}) Y1.4(VDD)
CLK_12M_a: R1.1 Y1.3(Output)
CLK_12M_b: R1.2 U1.L17(IO_L12P_T1_MRCC_14)
SDC_CDA: R2.1 SKT1.9(CD_A) U1.C15(IO_L11P_T1_SRCC_16)
SDC_CDB: R3.1 SKT1.10(CD_B) U1.B15(IO_L11N_T1_SRCC_16)
SDC_CLK: R4.1 SKT1.5(CLK) U1.A16(IO_L12P_T1_MRCC_16)
SDC_CMD: R5.1 SKT1.3(CMD) U1.A17(IO_L12N_T1_MRCC_16)
SDC_DAT0: R6.1 SKT1.7(DAT0) U1.C16(IO_L13P_T2_MRCC_16)
SDC_DAT1: R7.1 SKT1.8(DAT1) U1.B16(IO_L13N_T2_MRCC_16)
SDC_DAT2: R8.1 SKT1.1(DAT2) U1.C17(IO_L14P_T2_SRCC_16)
SDC_DAT3: SKT1.2(CD/DAT3) U1.B17(IO_L14N_T2_SRCC_16)
SRAM-A0: U1.P19(IO_L10P_T1_D14_14) U2.A1(A0)
SRAM-A1: U1.N19(IO_L9N_T1_DQS_D13_14) U2.A2(A1)
SRAM-A2: U1.R19(IO_L10N_T1_D15_14) U2.B2(A2)
SRAM-A3: U1.E19(IO_L3N_T0_DQS_EMCCLK_14) U2.A4(A3)
SRAM-A4: U1.D19(IO_L1N_T0_D01_DIN_14) U2.B4(A4)
SRAM-A5: U1.J19(IO_L6N_T0_D08_VREF_14) U2.C4(A5)
SRAM-A6: U1.F18(IO_L2N_T0_D03_14) U2.A5(A6)
SRAM-A7: U1.G18(IO_L2P_T0_D02_14) U2.B5(A7)
SRAM-A8: U1.E18(IO_L3P_T0_DQS_PUDC_B_14) U2.A6(A8)
SRAM-A9: U1.R18(IO_L14N_T2_SRCC_14) U2.H1(A9)
SRAM-A10: U1.U19(IO_L15P_T2_DQS_RDWR_B_14) U2.H2(A10)
SRAM-A11: U1.V19(IO_L15N_T2_DQS_DOUT_CSO_B_14) U2.H3(A11)
SRAM-A12: U1.W19(IO_L16N_T2_A15_D31_14) U2.H4(A12)
SRAM-A13: U1.W18(IO_L16P_T2_CSI_B_14) U2.H5(A13)
SRAM-A14: U1.W17(IO_L20N_T3_A07_D23_14) U2.H6(A14)
SRAM-A15: U1.U17(IO_L18P_T2_A12_D28_14) U2.G5(A15)
SRAM-A16: U1.U18(IO_L18N_T2_A11_D27_14) U2.G4(A16)
SRAM-A17: U1.T18(IO_L17N_T2_A13_D29_14) U2.F4(A17)
SRAM-A18: U1.K19(IO_L6P_T0_FCS_B_14) U2.F3(A18)
SRAM-CE_n: U1.N18(IO_L9P_T1_DQS_14) U2.G3(~{CE})
SRAM-DQ0: U1.W16(IO_L20P_T3_A08_D24_14) U2.B6(I/O0)
SRAM-DQ1: U1.G19(IO_L4N_T0_D05_14) U2.C6(I/O1)
SRAM-DQ2: U1.V15(IO_L21P_T3_DQS_14) U2.F6(I/O2)
SRAM-DQ3: U1.W15(IO_L21N_T3_DQS_A06_D22_14) U2.G6(I/O3)
SRAM-DQ4: U1.K18(IO_L8N_T1_D12_14) U2.B1(I/O4)
SRAM-DQ5: U1.J18(IO_L7N_T1_D10_14) U2.C1(I/O5)
SRAM-DQ6: U1.L18(IO_L8P_T1_D11_14) U2.F1(I/O6)
SRAM-DQ7: U1.T17(IO_L17P_T2_A14_D30_14) U2.G1(I/O7)
SRAM-OE_n: U1.M18(IO_L11P_T1_SRCC_14) U2.G2(~{OE})
SRAM-WE_n: U1.H19(IO_L4P_T0_D04_14) U2.B3(~{WE})

Not connected (* = marked no-connect by the designer): U1 A14(IO_L6P_T0_16) A15(IO_L6N_T0_VREF_16) A18(IO_L19N_T3_VREF_16) B18(IO_L19P_T3_16) D17(IO_0_14)* D18(IO_L1P_T0_D00_MOSI_14)* G17(IO_L5N_T0_D07_14)* H17(IO_L5P_T0_D06_14)* J17(IO_L7P_T1_D09_14)* K17(IO_L12N_T1_MRCC_14)* M19(IO_L11N_T1_SRCC_14)* N17(IO_L13P_T2_MRCC_14)* P17(IO_L13N_T2_MRCC_14)* P18(IO_L14P_T2_SRCC_14) U14(IO_25_14)* U15(IO_L23P_T3_A03_D19_14)* U16(IO_L23N_T3_A02_D18_14)* V13(IO_L24P_T3_A01_D17_14)* V14(IO_L24N_T3_A00_D16_14)* V16(IO_L19P_T3_A10_D26_14)* V17(IO_L19N_T3_A09_D25_VREF_14)* W13(IO_L22P_T3_A05_D21_14)* W14(IO_L22N_T3_A04_D20_14)*; U2 A3(NC)* C3(NC)*

### Layout directives
net class SRAM_NET_CLASS; rule Fanout Control [Style - BGA    Direction - Alternating In and Out Via Grid = 1mil]; rule Matched Net Lengths [Delay Tolerance = 100ps]: SRAM-DQ0, SRAM-DQ1, SRAM-DQ2, SRAM-DQ3, SRAM-DQ4, SRAM-DQ5, SRAM-DQ6, SRAM-DQ7
net class SRAM_NET_CLASS: SRAM-A0, SRAM-A1, SRAM-A2, SRAM-A3, SRAM-A4, SRAM-A5, SRAM-A6, SRAM-A7, SRAM-A8, SRAM-A9, SRAM-A10, SRAM-A11, SRAM-A12, SRAM-A13, SRAM-A14, SRAM-A15, SRAM-A16, SRAM-A17, SRAM-A18, SRAM-CE_n, SRAM-OE_n, SRAM-WE_n

### Notes on the sheet
- Artix-7 Clock and SRAM Connections
- Artix 7 FPGA
- SRAM - 512x8
- 12 Megahertz CMOS Clock
- SD Card Holder
- (in symbol CMP-0383-00006-1, part A) BANK 14
- (in symbol CMP-0383-00006-1, part B) BANK 16

### Library data of the parts
C1 = CMP-001-00055-5: Chip Capacitor, 1µF +/-0.1%, 25V, 0603, Thickness 1 mm; Tolerance: 20%; Min Operating Temperature: -55°C; Voltage Rating: 25V; Pins: 2; Mounting Technology: SMT; Max Operating Temperature: 85°C
C2 = CMP-001-00065-5: Chip Capacitor, 100nF +/-20%, 25V, 0402, Thickness 0.6 mm; Tolerance: 10%; Voltage Rating: 25V; Min Operating Temperature: -55°C; Mounting Technology: SMT; Pins: 2; Max Operating Temperature: 85°C
C3 = CMP-001-00077-4: Chip Capacitor, 470nF +/-20%, 25V, 0603, Thickness 1 mm; Tolerance: 10%; Pins: 2; Mounting Technology: SMT; Voltage Rating: 25V; Max Operating Temperature: 85°C; Min Operating Temperature: -55°C
C4 = CMP-001-00069-4: Chip Capacitor, 10nF +/-20%, 50V, 0402, Thickness 0.6 mm; Tolerance: 5%; Pins: 2; Mounting Technology: SMT; Max Operating Temperature: 85°C; Voltage Rating: 50V; Min Operating Temperature: -55°C
R1 = CMP-1659-00036-1: General Purpose Chip Resistor, 49.9 Ohm, +/- 1%, -55 to 155 degC, 0603 (1608 Metric), RoHS, Tape and Reel; Max Supply Voltage: 3.63 V; Case\Package: LQFP; Interface: SPI; Min Supply Voltage: 2.97 V; Packaging: Tray; ComponentLink2Description: Datasheet; ComponentLink1Description: Manufacturer URL; ComponentLink2URL: https://datasheet.ciiva.com/11808/0900766b80f96399-11808223.pdf; RoHSCompliant: true; Max Operating Temperature: 85 degC; ComponentLink1URL: http://www.yageo.com/; PackageDescription: 2-Pin Surface Mount Device, Body 1.6 x 0.8 mm; DatasheetVersion: Rev. 4, 04/2009; Min Operating Temperature: -40 degC; Package Quantity: 250; Pins: 48
R2-R8 = CMP-009-00103-4: 47K5 0.063W 1% 0402 (1005 Metric)  SMD; Power: 63mW; Pins: 2; Tolerance: 1%; Mounting Technology: SMT; Case/Package: 0402
SKT1 = CMP-002-00049-3: Micro SD Card Connector, Pitch 1.1 mm, 8 Position, Height 1.4 mm, -25 to 85 degC, RoHS, Tape and Reel; Pins: 14
U1 = CMP-0383-00006-1: as U1 on sheet Artix7_IO_General; ComponentLink1URL: http://www.xilinx.com/; Maximum Distributed RAM: 400 Kb; PackageVersion: Rev. 1.11; PartNumber: XC7A35T-1CPG236C; ComponentLink2URL: http://www.xilinx.com/support/documentation/data_sheets/ds180_7Series_Overview.pdf; DatasheetVersion: Rev. 1.15; ComponentLink1Description: Manufacturer URL; ComponentLink3Description: Pinout; ComponentLink4Description: Package Specification; Mounting Technology: Surface Mount; PackageReference: CPG-236; Operating Temperature Range: Commercial; PackageDescription: 238-Ball Wire-Bond Chip-Scale BGA, Body 10 x10 mm, Pitch 0.5 mm; ComponentLink3URL: http://www.xilinx.com/support/documentation/user_guides/ug475_7Series_Pkg_Pinout.pdf; ComponentLink4URL: http://www.xilinx.com/support/documentation/user_guides/ug475_7Series_Pkg_Pinout.pdf; ComponentLink2Description: Datasheet
U2 = CMP-0513-00068-2: NexarPartId: 11886108; Density: 4Mb; Min Supply Voltage: 2.4V; Memory Type: SRAM; Number of Words: 512000; Nominal Supply Current: 40mA; Access Time: 10ns; Interface: Parallel; Memory Size: 512kB; Number of Ports: 1; Word Size: 8b; Sync/Async: Asynchronous; Address Bus Width: 19b; Max Supply Voltage: 3.6V; Number of Pins: 36; RoHS: Compliant; Min Operating Temperature: -40°C; Height: 1.2mm; Case/Package: BGA; Max Operating Temperature: 85°C; Ambient Temperature Range High: 85°C; Schedule B: 8542320040, 8542320040; Radiation Hardening: No
Y1 = CMP-27762-002611-1: MEMS Oscillator 12MHz ±50ppm LVCMOS 3.3V SMD 2.5x2mm; Load Capacitance: 15pF; Min Supply Voltage: 3V; Max Supply Voltage: 3.6V; Max Supply Current: 10mA; Length: 0.098inch; Operating Supply Voltage: 3.3V; Number of Pins: 4; Packaging: Tape and Reel; Height: 0.035inch; Width: 0.079inch; Mount: Surface Mount; Case/Package: SMD/SMT; Series: Pure Silicon™ ASDM; Lead Free: Lead Free; Frequency: 12MHz; Max Operating Temperature: 85°C; RoHS Compliant: Yes; Package Quantity: 1000; Min Operating Temperature: -40°C; Operating Frequency: 12 MHz; Termination: SMD/SMT; Frequency Stability: 50ppm